# EAGLE design ext_esp32_M (EAGLE 9.6.2)
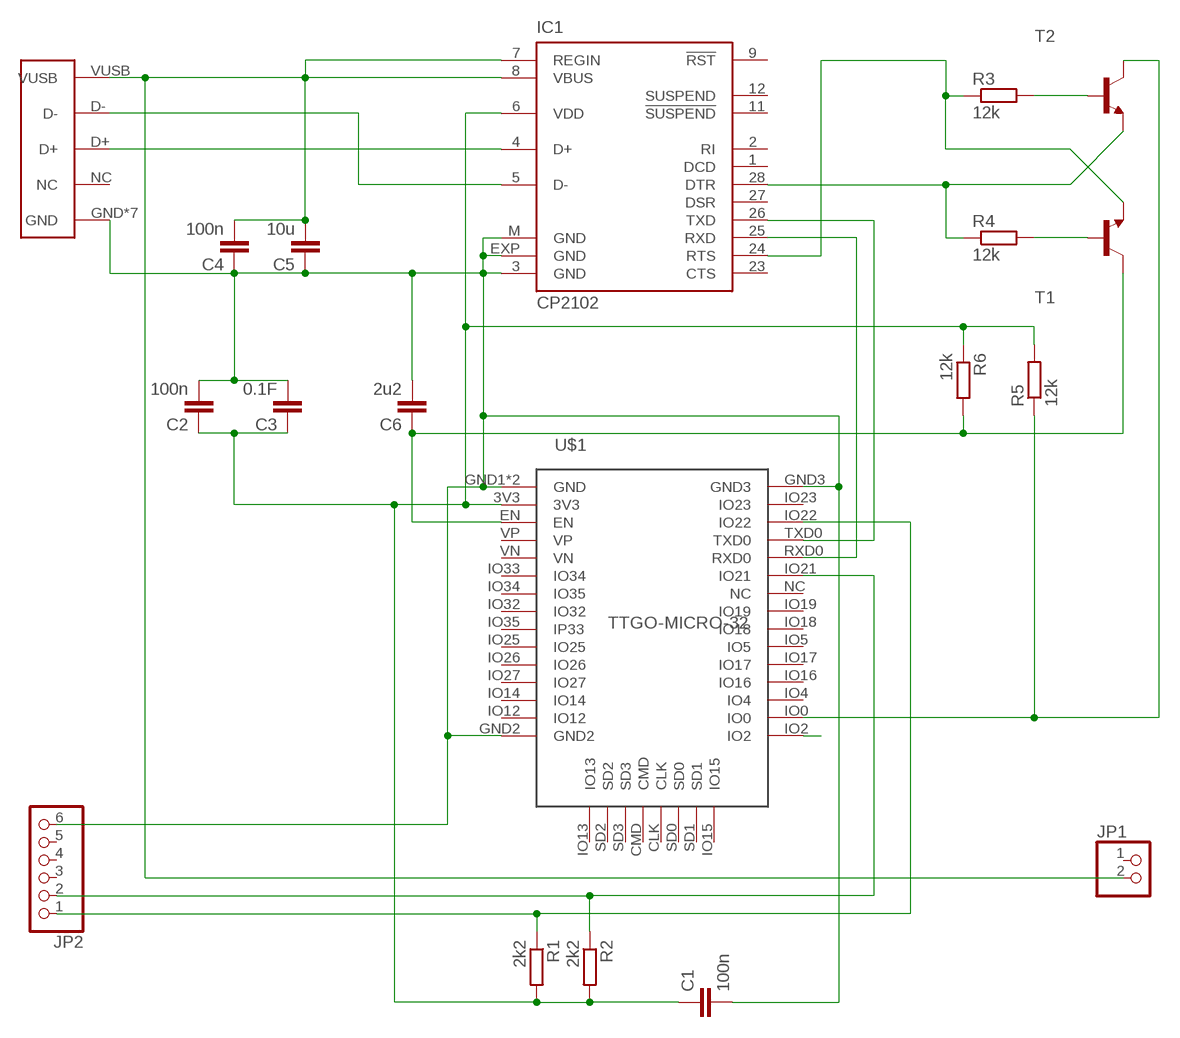
[diagram p0: schematic, sheet 1]

## Parts
C1  100n  C-EUC0603  [C0603]
C2  100n  C-EUC0603  [C0603]
C3  0.1F  C-EUC0603  [C0603]
C4  100n  C-EUC0603  [C0603]
C5  10u  C-EUC0603  [C0603]
C6  2u2  C-EUC0603  [C0603]
IC1  CP2102  [MLP28]
JP1  PINHD-1X2  [1X02]
JP2  PINHD-1X6  [1X06]
R1  2k2  R-EU_R0603  [R0603]
R2  2k2  R-EU_R0603  [R0603]
R3  12k  R-EU_R0603  [R0603]
R4  12k  R-EU_R0603  [R0603]
R5  12k  R-EU_R0603  [R0603]
R6  12k  R-EU_R0603  [R0603]
T1  BC808-NPN-SOT23-BEC  [SOT23-BEC]
T2  BC808-NPN-SOT23-BEC  [SOT23-BEC]
U$1  TTGO-MICRO-32  [TTGO-MICRO-32]
USB  MICRO-USB  [MICRO-USB]

## Nets
DTR: IC1.28(DTR) R4.1 T2.E
GND: C1.2 C2.2 C3.2 C4.1 C5.1 C6.2 IC1.3(GND) IC1.EXP(GND) IC1.M(GND) JP2.6 U$1.GND1(GND) U$1.GND2 U$1.GND3 U$1.GND4(GND) USB.GND USB.GND1(GND) USB.GND2(GND) USB.GND3(GND) USB.GND4(GND) USB.P$1(GND) USB.P$2(GND)
N$1: IC1.5(D-) USB.D-
N$2: IC1.4(D+) USB.D+
N$3: IC1.26(TXD) U$1.TXD0
N$5: R4.2 T1.B
N$6: IC1.25(RXD) U$1.RXD0
N$7: R3.2 T2.B
N$10: R5.1 T2.C U$1.IO0
N$11: C6.1 R6.2 T1.C U$1.EN
N$13: U$1.IO2
RTS: IC1.24(RTS) R3.1 T1.E
SCL: JP2.1 R1.1 U$1.IO22
SDA: JP2.2 R2.1 U$1.IO21
VDD: C1.1 C2.1 C3.1 IC1.6(VDD) R1.2 R2.2 R5.2 R6.1 U$1.3V3
VUSB: C4.2 C5.2 IC1.7(REGIN) IC1.8(VBUS) JP1.2 USB.VUSB
Unconnected: IC1.1(DCD) IC1.2(RI) IC1.9(!RST) IC1.11(!SUSPEND) IC1.12(SUSPEND) IC1.23(CTS) IC1.27(DSR) JP1.1 JP2.3 JP2.4 JP2.5 U$1.CLK U$1.CMD U$1.IO4 U$1.IO5 U$1.IO12 U$1.IO13 U$1.IO14 U$1.IO15 U$1.IO16 U$1.IO17 U$1.IO18 U$1.IO19 U$1.IO23 U$1.IO25 U$1.IO26 U$1.IO27 U$1.IO32 U$1.IO33(IO34) U$1.IO34(IO35) U$1.IO35(IP33) U$1.NC U$1.SD0 U$1.SD1 U$1.SD2 U$1.SD3 U$1.VN U$1.VP USB.NC

## Library data of the parts
C1-C6 = rcl:C-EU: CAPACITOR, European symbol; SPICEPREFIX: C
IC1 = silabs:CP210*: Single-Chip USB to UART Bridge Source: www.silabs.com .. CP2101.pdf / cp2102.pdf; MF: FARNELL; MPN: CP2102-GM; OC_FARNELL: 9282130; OC_NEWARK: 30K5635
JP1 = pinhead2:PINHD-1X2: PIN HEADER
JP2 = pinhead2:PINHD-1X6: PIN HEADER
R1-R6 = rcl:R-EU_: RESISTOR, European symbol; SPICEPREFIX: R
T1 T2 = transistor:*-NPN-: NPN Transistror BF959 corrected 2008.03.06
U$1 = hugo:TTGO-MICRO-32
USB = hugo:MICRO-USB

## Board
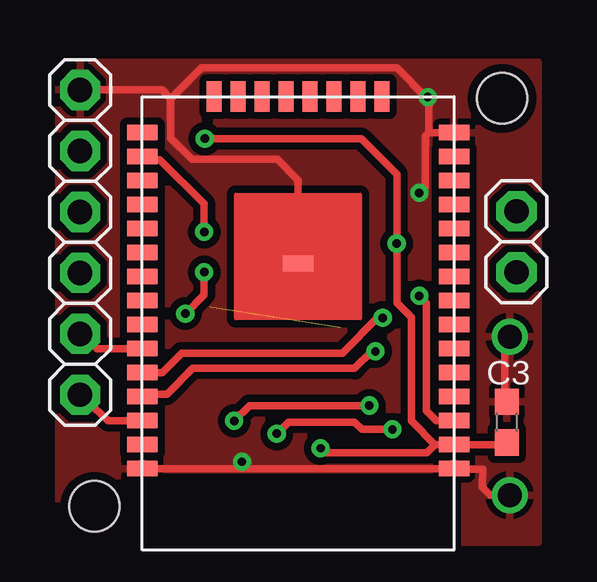
[diagram p1: board, top side]
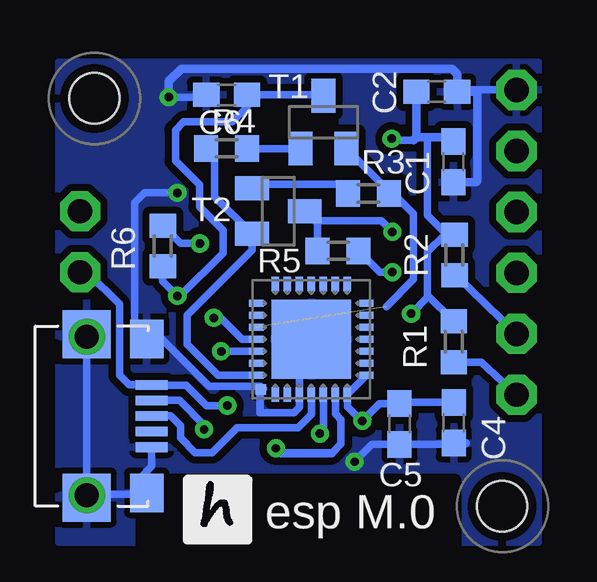
[diagram p2: board, bottom side, seen from below]

No outline drawn. Coordinates in mm, seen from the top.
Copper layers (1*16): Top 0.035mm / dielectric 1.5mm / Bottom 0.035mm
Design rules "default *": minimum track width 10mil, minimum drill 0.35mm, track to track 6mil, track to pad 6mil, pad to pad 6mil, via to via 10mil, smd to smd 10mil, copper to edge 15mil, drill to drill 40mil, minimum pad ring 10mil, minimum via ring 8mil, stop-mask expansion 4mil, vias tented up to drill 0mil, thermal gap 10mil
Holes 2.1 mm at 2,2 19,19

### Footprints (pad centres in the part's own frame; a part is rotated, then mirrored left to right if it is on the bottom)
C0603 = smd 1.1 x 1: 1 -0.85,0; 2 0.85,0
MLP28 = smd 0.6 x 0.3: 1 -2.3,1.5; 2 -2.3,1; 3 -2.3,0.5; 4 -2.3,0; 5 -2.3,-0.5; 6 -2.3,-1; 7 -2.3,-1.5; 15 2.3,-1.5; 16 2.3,-1; 17 2.3,-0.5; 18 2.3,0; 19 2.3,0.5; 20 2.3,1; 21 2.3,1.5 | smd 0.3 x 0.6: 8 -1.5,-2.3; 9 -1,-2.3; 10 -0.5,-2.3; 11 0,-2.3; 12 0.5,-2.3; 13 1,-2.3; 14 1.5,-2.3; 22 1.5,2.3; 23 1,2.3; 24 0.5,2.3; 25 0,2.3; 26 -0.5,2.3; 27 -1,2.3; 28 -1.5,2.3 | smd 3.3 x 3.3: EXP 0,0 | smd 0.435 x 0.435: M -2.103,2.103
1X02 = drill 1.016 pad 1.676 octagon: 1 -1.27,0; 2 1.27,0
1X06 = drill 1.016 pad 1.676 octagon: 1 -6.35,0; 2 -3.81,0; 3 -1.27,0; 4 1.27,0; 5 3.81,0; 6 6.35,0
R0603 = smd 1 x 1.1: 1 -0.85,0; 2 0.85,0
SOT23-BEC = smd 1 x 1.4: B -0.95,-1.1; C 0,1.1; E 0.95,-1.1
TTGO-MICRO-32 = smd 1.27 x 0.635: 3V3 -6.5,5; EN -6.5,4; GND1 -6.5,6; GND2 -6.5,-8; GND3 6.5,6; GND4 0,-2.54; IO0 6.5,-7; IO2 6.5,-8; IO4 6.5,-6; IO5 6.5,-3; IO12 -6.5,-7; IO14 -6.5,-6; IO16 6.5,-5; IO17 6.5,-4; IO18 6.5,-2; IO19 6.5,-1; IO21 6.5,1; IO22 6.5,4; IO23 6.5,5; IO25 -6.5,-3; IO26 -6.5,-4; IO27 -6.5,-5; IO32 -6.5,-1; IO33 -6.5,-2; IO34 -6.5,1; IO35 -6.5,0; NC 6.5,0; RXD0 6.5,2; TXD0 6.5,3; VN -6.5,2; VP -6.5,3 | smd 0.635 x 1.27: CLK 0.5,-9.5; CMD -0.5,-9.5; IO13 -3.5,-9.5; IO15 3.5,-9.5; SD0 1.5,-9.5; SD1 2.5,-9.5; SD2 -2.5,-9.5; SD3 -1.5,-9.5
MICRO-USB = smd 0.4 x 1.35: D+ 0,2.5; D- -0.65,2.5; GND 1.3,2.5; NC 0.65,2.5; VUSB -1.3,2.5 | smd 2 x 2: GND1 -3.4,-0.2; GND2 3.4,-0.2 | smd 1.6 x 1.4: GND3 -3.202,2.3; GND4 3.2,2.3 | drill 1: P$1 -3.3,-0.2; P$2 3.3,-0.2

### Placement (x,y rotation side)
C1  4.04,16.36 270 bottom
C2  4.72,19.28 0 bottom
C3  19.2,5.51 90 top
C4  4.01,5.49 90 bottom
C5  6.27,5.44 90 bottom
C6  13.49,19.15 180 bottom
IC1  9.96,8.97 90 bottom
JP1  19.6,13.03 270 top
JP2  1.4,13 90 top
R1  4.01,8.86 90 bottom
R2  3.99,12.47 90 bottom
R3  7.57,15.04 180 bottom
R4  13.49,16.92 0 bottom
R5  8.84,12.65 0 bottom
R6  16.15,12.85 270 bottom
T1  9.45,18.01 0 bottom
T2  11.33,14.3 270 bottom
U$1  10.49,9.58 180 top
USB  19.12,5.77 270 bottom

### Tracks (layer width: path | path; a pad name or v marks a point on that pad's centre or on a via)
DTR
  Bottom 0.305: IC1.28 13.84,7.47 15.14,8.76 15.14,9.96 12.43,12.67 T2.E 13.98,14.9 13.98,16.56 R4.1
GND  (via drill 0.35)
  Top 0.305: 15.95,17.58 U$1.GND2 | 15.95,17.58 15.8,17.42 15.8,15.31 v15.54,15.06 | U$1.GND4 10.49,15.6 9.63,16.46 6.07,16.46 5.18,17.35 5.18,18.98 | USB.P$1 19.11,8.86 19.11,6.45 C3.2 | 8.05,3.56 16.97,3.56 U$1.GND1 17.02,3.55 18.19,3.55 18.19,2.79 18.52,2.47 USB.P$2 | 8.05,3.56 4.25,3.56 4.23,3.58 U$1.GND3 3.86,3.58 | 15.95,17.58 15.95,19 v15.9,19.05 15.83,19.05 14.61,20.27 6.47,20.27 5.18,18.98 | v8.15,3.86 8.15,3.66 8.05,3.56 | JP2.6 4.81,19.35 5.18,18.98
  Bottom 0.305: IC1.3 10.46,8.47 IC1.EXP | IC1.3 10.48,6.65 | 17.2,2.52 16.87,2.52 USB.GND4 | 17.2,2.52 19.17,2.52 USB.GND2 USB.GND1 | 19.22,8.97 USB.P$1 | 15.58,15.1 v15.54,15.06 16.92,15.06 17.32,14.65 17.32,9.48 USB.GND3 16.18,8.97 14.22,7.01 12.06,7.01 11.96,6.9 IC1.M 12.09,6.83 12.09,5.91 10.68,5.91 10.45,6.14 IC1.3 | C6.2 14.44,19.05 v15.9,19.05 | 17.2,2.52 17.14,2.57 17.14,3.14 16.62,3.67 USB.GND | C4.1 4.06,4.59 C5.1 7.43,4.59 v8.15,3.86 | JP2.6 3.8,19.35 C2.2
  Bottom 0.356: C1.2 3.08,15.51 3.02,15.57 3.02,19.18 3.12,19.28 C2.2 3.87,20.02 4.1,20.24 15.37,20.24 15.9,19.71 v15.9,19.05 | C4.1 3.51,4.64
  pour Top (isolate 0.305): 0.5,0.5 0.5,20.5 20.5,20.5 20.5,0.5
  pour Bottom (isolate 0.305): 0.5,20.5 20.5,20.5 20.5,0.5 0.5,0.5
N$1  (via drill 0.35)
  Top 0.305: v14.43,5.21 13.16,5.21 12.85,5.51 10.08,5.51 v9.6,5.03
  Bottom 0.305: 14.61,5.21 v14.43,5.21 14.43,5.38 15.46,6.42 USB.D- | IC1.5 9.46,5.17 v9.6,5.03
N$2
  Bottom 0.305: IC1.4 9.96,5.83 10.51,5.28 13.06,5.28 14.1,4.24 14.8,4.24 15.41,4.86 15.41,5.36 15.83,5.77 USB.D+
N$3  (via drill 0.35)
  Top 0.305: v13.72,8.46 13.56,8.46 12.85,7.75 6.1,7.75 5.03,6.68 4.12,6.68 U$1.TXD0
  Bottom 0.305: v13.72,8.46 13.71,8.47 IC1.26
N$5
  Bottom 0.305: 10.13,16.91 T1.B 12.63,16.91 R4.2
N$6  (via drill 0.35)
  Top 0.305: v14.02,9.86 13.81,9.86 12.34,8.38 5.63,8.38 4.82,7.58 U$1.RXD0
  Bottom 0.305: IC1.25 12.84,8.97 13.73,9.86 v14.02,9.86
N$7
  Bottom 0.305: 12.25,15.43 T2.B 12.26,15.42 8.8,15.42 R3.2 8.23,14.67
N$10  (via drill 0.35)
  Top 0.305: U$1.IO0 4.12,16.45 4.73,16.45 6.58,14.6 v6.58,13.44
  Bottom 0.254: 9.6,13.89 9.82,13.89
  Bottom 0.305: T2.C 9.82,13.89 9.69,13.89 R5.1 | 9.6,13.89 7.04,13.89 v6.58,13.44
N$11  (via drill 0.35)
  Top 0.305: v15.54,10.77 15.85,10.47 15.85,5.99 16.27,5.58 U$1.EN
  Bottom 0.305: T1.C 9.49,19.15 C6.1 12.64,18.63 13.26,18.02 15.28,18.02 15.62,17.68 15.62,16.41 14.62,15.4 14.62,14.49 13.64,13.51 13.64,12.55 15.42,10.77 v15.54,10.77 16.15,11.38 R6.2
RTS  (1 unrouted)
  Bottom 0.305: T1.E 6.72,15.13 R3.1 6.54,15.04 5.69,14.19 5.69,11.46 6.83,10.31
SCL
  Top 0.305: U$1.IO22 2.57,5.58 JP2.1
  Bottom 0.305: JP2.1 2.87,8.02 R1.1
SDA
  Top 0.305: U$1.IO21 2.11,8.58 JP2.2
  Bottom 0.305: JP2.2 3.93,11.62 R2.1
VDD  (via drill 0.35)
  Top 0.305: 16.2,4.58 U$1.3V3 19.11,4.57 C3.1 | 16.2,4.58 15.87,4.25 11.61,4.25 v11.43,4.42 | 16.2,4.58 15.21,5.57 15.21,9.88 14.61,10.49 v14.61,12.95 14.61,15.84 13.13,17.32 v6.6,17.32 | v6.58,11.76 6.58,10.82 v5.79,10.03
  Bottom 0.305: 5.97,19.28 C2.1 | 6.6,17.34 v6.6,17.32 6.54,17.26 5.69,17.26 | 5.12,17.37 5.12,14.13 4.3,13.32 R2.2 4.39,13.32 5.11,12.61 5.11,10.81 | IC1.6 8.96,5.85 8.71,5.61 8.71,4.6 9.1,4.22 | 5.11,10.81 R1.2 | R6.1 15.41,12.95 v14.61,12.95 | R5.2 7.1,11.76 v6.58,11.76 | v5.79,10.03 5.11,10.72 5.11,10.81
  Bottom 0.356: C2.1 5.57,17.37 | 5.57,17.37 5.69,17.26 | C1.1 4.21,17.37 5.12,17.37 5.57,17.37 | v11.43,4.42 11.22,4.22 9.1,4.22
VUSB  (via drill 0.35)
  Top 0.305: v13.46,6.2 8.47,6.2 v7.83,5.56
  Bottom 0.305: IC1.8 IC1.7 8.46,6.15 7.87,5.56 v7.83,5.56 7.11,6.29 C5.2 6.22,6.34 C4.2 | v13.46,6.2 14.32,6.2 15.17,7.05 16.6,7.05 USB.VUSB 17.56,7.07 17.96,7.47 17.96,10.42 19.3,11.76 JP1.2

### Text on the board
bPlace: esp M.0